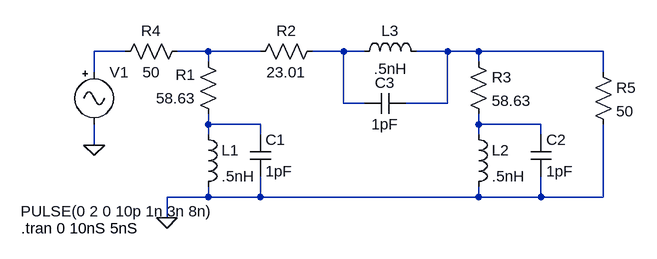
[diagram p0: schematic PiAttenuator.asc]
PiAttenuator.asc, the LTspice schematic file:
Version 4
SHEET 1 904 680
WIRE 112 80 64 80
WIRE 240 80 192 80
WIRE 320 80 240 80
WIRE 448 80 400 80
WIRE 480 80 448 80
WIRE 608 80 560 80
WIRE 656 80 608 80
WIRE 848 80 656 80
WIRE 240 96 240 80
WIRE 656 96 656 80
WIRE 64 112 64 80
WIRE 848 112 848 80
WIRE 448 160 448 80
WIRE 480 160 448 160
WIRE 608 160 608 80
WIRE 608 160 544 160
WIRE 240 192 240 176
WIRE 320 192 240 192
WIRE 656 192 656 176
WIRE 752 192 656 192
WIRE 240 208 240 192
WIRE 320 208 320 192
WIRE 656 208 656 192
WIRE 752 208 752 192
WIRE 64 224 64 192
WIRE 240 304 240 288
WIRE 240 304 176 304
WIRE 320 304 320 272
WIRE 320 304 240 304
WIRE 656 304 656 288
WIRE 656 304 320 304
WIRE 752 304 752 272
WIRE 752 304 656 304
WIRE 848 304 848 192
WIRE 848 304 752 304
WIRE 176 336 176 304
FLAG 64 224 0
FLAG 176 336 0
SYMBOL res 256 192 R180
WINDOW 0 36 76 Left 0
WINDOW 3 36 40 Left 0
SYMATTR InstName R1
SYMATTR Value 58.63
SYMBOL res 304 96 R270
WINDOW 0 32 56 VTop 0
WINDOW 3 0 56 VBottom 0
SYMATTR InstName R2
SYMATTR Value 23.01
SYMBOL res 640 80 R0
SYMATTR InstName R3
SYMATTR Value 58.63
SYMBOL res 96 96 R270
WINDOW 0 32 56 VTop 0
WINDOW 3 0 56 VBottom 0
SYMATTR InstName R4
SYMATTR Value 50
SYMBOL res 832 96 R0
SYMATTR InstName R5
SYMATTR Value 50
SYMBOL ind 224 192 R0
SYMATTR InstName L1
SYMATTR Value .5nH
SYMBOL ind 640 192 R0
SYMATTR InstName L2
SYMATTR Value .5nH
SYMBOL cap 304 208 R0
SYMATTR InstName C1
SYMATTR Value 1pF
SYMBOL cap 736 208 R0
SYMATTR InstName C2
SYMATTR Value 1pF
SYMBOL Misc\\signal 64 96 R0
WINDOW 3 -113 230 Left 0
WINDOW 123 0 0 Left 0
WINDOW 39 0 0 Left 0
SYMATTR InstName V1
SYMATTR Value PULSE(0 2 0 10p 1n 3n 8n)
SYMBOL ind 464 96 R270
WINDOW 0 32 56 VTop 0
WINDOW 3 5 56 VBottom 0
SYMATTR InstName L3
SYMATTR Value .5nH
SYMBOL cap 544 144 R90
WINDOW 0 0 32 VBottom 0
WINDOW 3 32 32 VTop 0
SYMATTR InstName C3
SYMATTR Value 1pF
TEXT -48 352 Left 0 !.tran 0 10nS 5nS

The netlist it stands for:
* PiAttenuator.asc
R1 N005 N002 58.63
R2 N002 N003 23.01
R3 N004 N006 58.63
R4 N001 N002 50
R5 N004 0 50
L1 N005 0 .5nH
L2 N006 0 .5nH
C1 N005 0 1pF
C2 N006 0 1pF
V1 N001 0 PULSE(0 2 0 10p 1n 3n 8n)
L3 N003 N004 .5nH
C3 N004 N003 1pF
.tran 0 10nS 5nS
.backanno
.end